# EasyEDA Pro project TC358870 HDMI2MIPI.epro, board PCB18
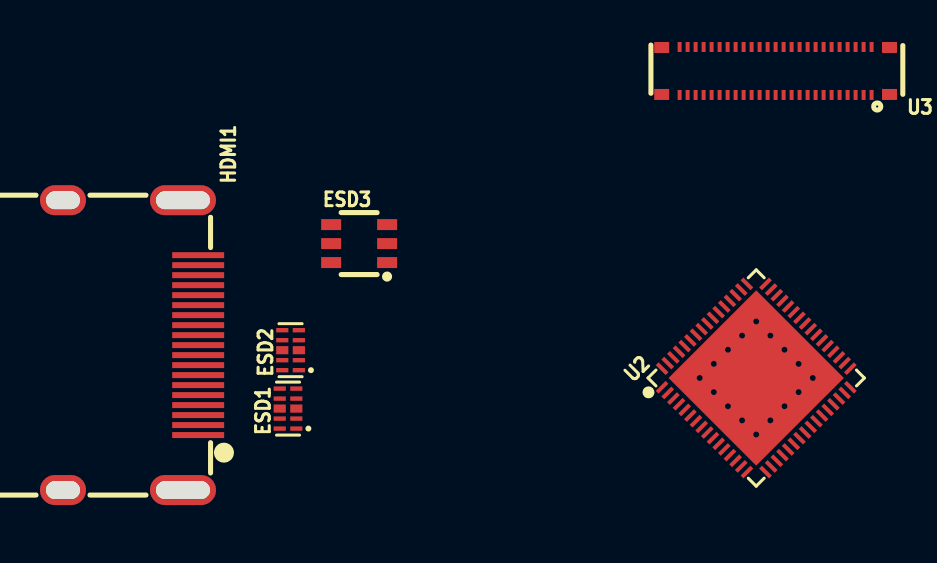
[diagram p10: board, top side]
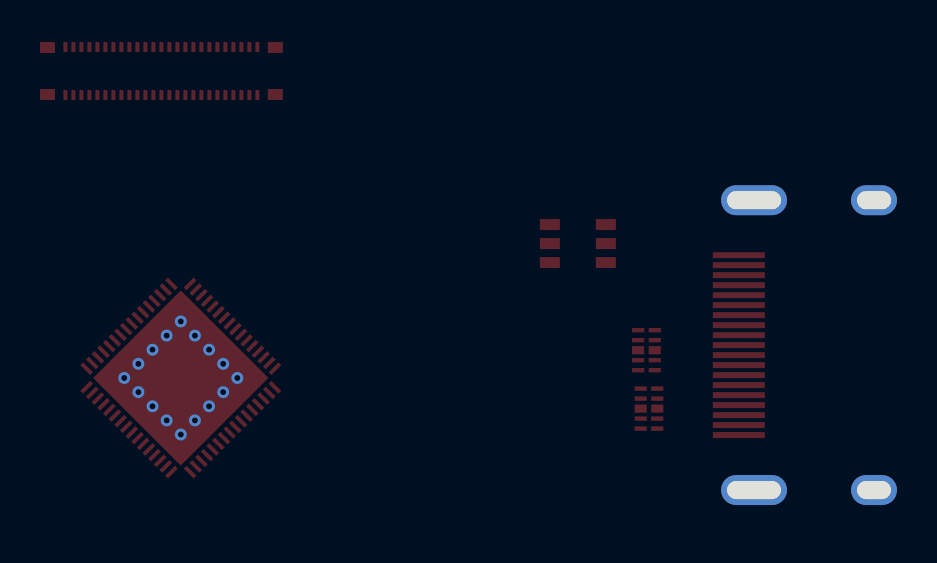
[diagram p11: board, bottom side, seen from below]

No outline. copper layers: Top Layer, Inner1, Inner2, Bottom Layer. Coordinates in mm from the lowest, leftmost part position.
Stack: Top Layer 0.035mm 外层铜厚1oz / Dielectric1 0.2104mm 7628 RC49% 8.6mil / Inner1 0.0152mm 内层铜厚 / Dielectric2 1.065mm 1.1mm H/HOZ Copper / Inner2 0.0152mm 内层铜厚 / Dielectric3 0.2104mm 7628 RC49% 8.6mil / Bottom Layer 0.035mm 外层铜厚1oz

## Design rules (mm)
net HDMI_CN: HDMI_C
net HDMI_CP: HDMI_C
net HDMI_D0N: HDMI_D0
net HDMI_D0P: HDMI_D0
net HDMI_D1N: HDMI_D1
net HDMI_D1P: HDMI_D1
net HDMI_D2N: HDMI_D2
net HDMI_D2P: HDMI_D2
net MIPI0_D0P: MIPI0_D0
net MIPI0_D0N: MIPI0_D0
net MIPI0_CP: MIPI0_C
net MIPI0_CN: MIPI0_C
net MIPI0_D2P: MIPI0_D2
net MIPI0_D2N: MIPI0_D2
net MIPI0_D3P: MIPI0_D3
net MIPI0_D3N: MIPI0_D3
net MIPI1_D3P: MIPI1_D3
net MIPI1_D3N: MIPI1_D3
net MIPI1_D2P: MIPI1_D2
net MIPI1_D2N: MIPI1_D2
net MIPI1_CP: MIPI1_C
net MIPI1_CN: MIPI1_C
net MIPI1_D1P: MIPI1_D1
net MIPI1_D1N: MIPI1_D1
net MIPI1_D0P: MIPI1_D0
net MIPI1_D0N: MIPI1_D0
template: 自定义配置
spacing copperThickness1oz (default): track to track 0.102, other pairs 0.102 to 0.3
spacing copperThickness2oz: track to track 0.203, other pairs 0.152 to 0.3
spacing copperThicknessInner0.5oz: track to track 0.089, other pairs 0.152 to 0.3
track width copperThickness1oz (default): min 0.102, default 0.254, max 2.54
track width copperThickness2oz: min 0.203, default 0.254, max 2.54
track width copperThickness0.5oz: min 0.089, default 0.254, max 2.54
differential pair differentialPair (default): width min 0.127, default 0.127, max 2.54; gap min 0.127, default 0.127
differential pair 5mil: width min 0.102, default 0.102, max 2.54; gap min 0.152, default 0.152
differential pair usb: width min 0.122, default 0.122, max 0.122; gap min 0.127, default 0.127
via viaSize (default): diameter min 0.399, default 0.399, max 10; hole min 0.3, default 0.3, max 6.299
net HDMI_CN uses 5mil
net HDMI_CP uses 5mil
net HDMI_D0N uses 5mil
net HDMI_D0P uses 5mil
net HDMI_D1N uses 5mil
net HDMI_D1P uses 5mil
net HDMI_D2N uses 5mil
net HDMI_D2P uses 5mil
net MIPI0_D0P uses 5mil
net MIPI0_D0N uses 5mil
net MIPI0_CP uses 5mil
net MIPI0_CN uses 5mil
net MIPI0_D2P uses 5mil
net MIPI0_D2N uses 5mil
net MIPI0_D3P uses 5mil
net MIPI0_D3N uses 5mil
diff pair HDMI_C uses 5mil
diff pair HDMI_D0 uses 5mil
diff pair HDMI_D1 uses 5mil
diff pair HDMI_D2 uses 5mil
diff pair MIPI0_D0 uses 5mil
diff pair MIPI0_C uses 5mil
diff pair MIPI0_D2 uses 5mil
diff pair MIPI0_D3 uses 5mil

## Placement (name value [footprint] x y rotation side)
ESD1  ESD7004MUTAG  [UDFN-10_L2.5-W1.0-P0.50-BL]  7.87 0 90 top
ESD2  ESD7004MUTAG  [UDFN-10_L2.5-W1.0-P0.50-BL]  8 2.92 90 top
ESD3  NUP4114HMR6T1G  [SOT-23-6_L2.9-W1.6-P0.95-LS2.8-BR]  11.43 8.26 0 top
HDMI1  HDMI 19PIN 043  [HDMI-SMD_HDMI-19PIN-043]  0 3.18 270 top
U2  f4db28bdf2dc421f869bca92a9156eee  [QFN-64_L7.5-W7.5-P0.40-TL-EP6.2]  31.29 1.53 45 top
U3  WP7B-S050VA1-R8000  [CONN-SMD_WP7B-S050VA1-R8000]  32.26 16.89 180 top

## Footprints (pads in the part's own frame, mm; a bottom-side part is the same pattern mirrored in y, then rotated)
CONN-SMD_WP7B-S050VA1-R8000
  rect 0.2x0.5 smd: 1(-4.8,1.2) 2(-4.8,-1.2) 3(-4.4,1.2) 4(-4.4,-1.2) 5(-4,1.2) 6(-4,-1.2) 7(-3.6,1.2) 8(-3.6,-1.2) 9(-3.2,1.2) 10(-3.2,-1.2) 11(-2.8,1.2) 12(-2.8,-1.2) 13(-2.4,1.2) 14(-2.4,-1.2) 15(-2,1.2) 16(-2,-1.2) 17(-1.6,1.2) 18(-1.6,-1.2) 19(-1.2,1.2) 20(-1.2,-1.2) 21(-0.8,1.2) 22(-0.8,-1.2) 23(-0.4,1.2) 24(-0.4,-1.2) 25(0,1.2) 26(0,-1.2) 27(0.4,1.2) 28(0.4,-1.2) 29(0.8,1.2) 30(0.8,-1.2) 31(1.2,1.2) 32(1.2,-1.2) 33(1.6,1.2) 34(1.6,-1.2) 35(2,1.2) 36(2,-1.2) 37(2.4,1.2) 38(2.4,-1.2) 39(2.8,1.2) 40(2.8,-1.2) 41(3.2,1.2) 42(3.2,-1.2) 43(3.6,1.2) 44(3.6,-1.2) 45(4,1.2) 46(4,-1.2) 47(4.4,1.2) 48(4.4,-1.2) 49(4.8,1.2) 50(4.8,-1.2)
  rect 0.75x0.55 smd: 51(-5.696,1.175) 52(5.696,1.175) 53(-5.696,-1.175) 54(5.696,-1.175)
HDMI-SMD_HDMI-19PIN-043
  rect 0.3x2.6 smd: 1(4.5,3.38) 2(4,3.38) 3(3.5,3.38) 4(3,3.38) 5(2.5,3.38) 6(2,3.38) 7(1.5,3.38) 8(1,3.38) 9(0.5,3.38) 10(0,3.38) 11(-0.5,3.38) 12(-1,3.38) 13(-1.5,3.38) 14(-2,3.38) 15(-2.5,3.38) 16(-3,3.38) 17(-3.5,3.38) 18(-4,3.38) 19(-4.5,3.38)
  oval 1.5x3.3 hole 0.9x2.7: 20(-7.25,2.62) 20(7.25,2.62)
  oval 1.5x2.3 hole 0.9x1.7: 20(-7.25,-3.38) 20(7.25,-3.38)
QFN-64_L7.5-W7.5-P0.40-TL-EP6.2
  rect 0.7x0.2 smd: 1(-3.658,3) 2(-3.658,2.6) 3(-3.658,2.2) 4(-3.658,1.8) 5(-3.658,1.4) 6(-3.658,1) 7(-3.658,0.6) 8(-3.658,0.2) 9(-3.658,-0.2) 10(-3.658,-0.6) 11(-3.658,-1) 12(-3.658,-1.4) 13(-3.658,-1.8) 14(-3.658,-2.2) 15(-3.658,-2.6) 16(-3.658,-3) 33(3.658,-3) 34(3.658,-2.6) 35(3.658,-2.2) 36(3.658,-1.8) 37(3.658,-1.4) 38(3.658,-1) 39(3.658,-0.6) 40(3.658,-0.2) 41(3.658,0.2) 42(3.658,0.6) 43(3.658,1) 44(3.658,1.4) 45(3.658,1.8) 46(3.658,2.2) 47(3.658,2.6) 48(3.658,3)
  rect 0.2x0.7 smd: 17(-3,-3.658) 18(-2.6,-3.658) 19(-2.2,-3.658) 20(-1.8,-3.658) 21(-1.4,-3.658) 22(-1,-3.658) 23(-0.6,-3.658) 24(-0.2,-3.658) 25(0.2,-3.658) 26(0.6,-3.658) 27(1,-3.658) 28(1.4,-3.658) 29(1.8,-3.658) 30(2.2,-3.658) 31(2.6,-3.658) 32(3,-3.658) 49(3,3.658) 50(2.6,3.658) 51(2.2,3.658) 52(1.8,3.658) 53(1.4,3.658) 54(1,3.658) 55(0.6,3.658) 56(0.2,3.658) 57(-0.2,3.658) 58(-0.6,3.658) 59(-1,3.658) 60(-1.4,3.658) 61(-1.8,3.658) 62(-2.2,3.658) 63(-2.6,3.658) 64(-3,3.658)
  rect 6.2x6.2 smd: 65(0,0)
SOT-23-6_L2.9-W1.6-P0.95-LS2.8-BR
  rect 1x0.55 smd: 1(1.4,-0.95) 2(1.4,0) 3(1.4,0.95) 4(-1.4,0.95) 5(-1.4,0) 6(-1.4,-0.95)
UDFN-10_L2.5-W1.0-P0.50-BL
  rect 0.22x0.609 smd: 1(-1,-0.414) 2(-0.5,-0.414) 4(0.5,-0.414) 5(1,-0.414) 6(1,0.414) 7(0.5,0.414) 9(-0.5,0.414) 10(-1,0.414)
  rect 0.41x0.609 smd: 3(0,-0.414) 8(0,0.414)

## Nets
As in the schematic.

Pads without a net: HDMI1 14; U2 1 4 7 10 13 14 15 16 17 18 19 20 21 22 23 24 25 26 27 28 29 30 31 32 33 34 45 46 47 48 59 60 61 62 63 64; U3 5 40 44 50

## Via types
v1: diameter 0.6, hole 0.3, Top Layer to Bottom Layer, 16 vias

## Routing (per net, layer and track width the routed paths; a pad name or vN(x,y) marks a point on that pad's centre or on a via; arc(x,y) is an arc through that point)
GND:
  vias: v1(28.46,1.53) v1(29.17,2.24) v1(29.17,0.82) v1(29.87,2.95) v1(29.87,0.12) v1(30.58,3.65) v1(30.58,-0.59) v1(31.29,4.36) v1(31.29,-1.3) v1(32,3.65) v1(32,-0.59) v1(32.7,2.95) v1(32.7,0.12) v1(33.41,2.24) v1(33.41,0.82) v1(34.12,1.53)
